# EAGLE design plug (EAGLE 4.16)
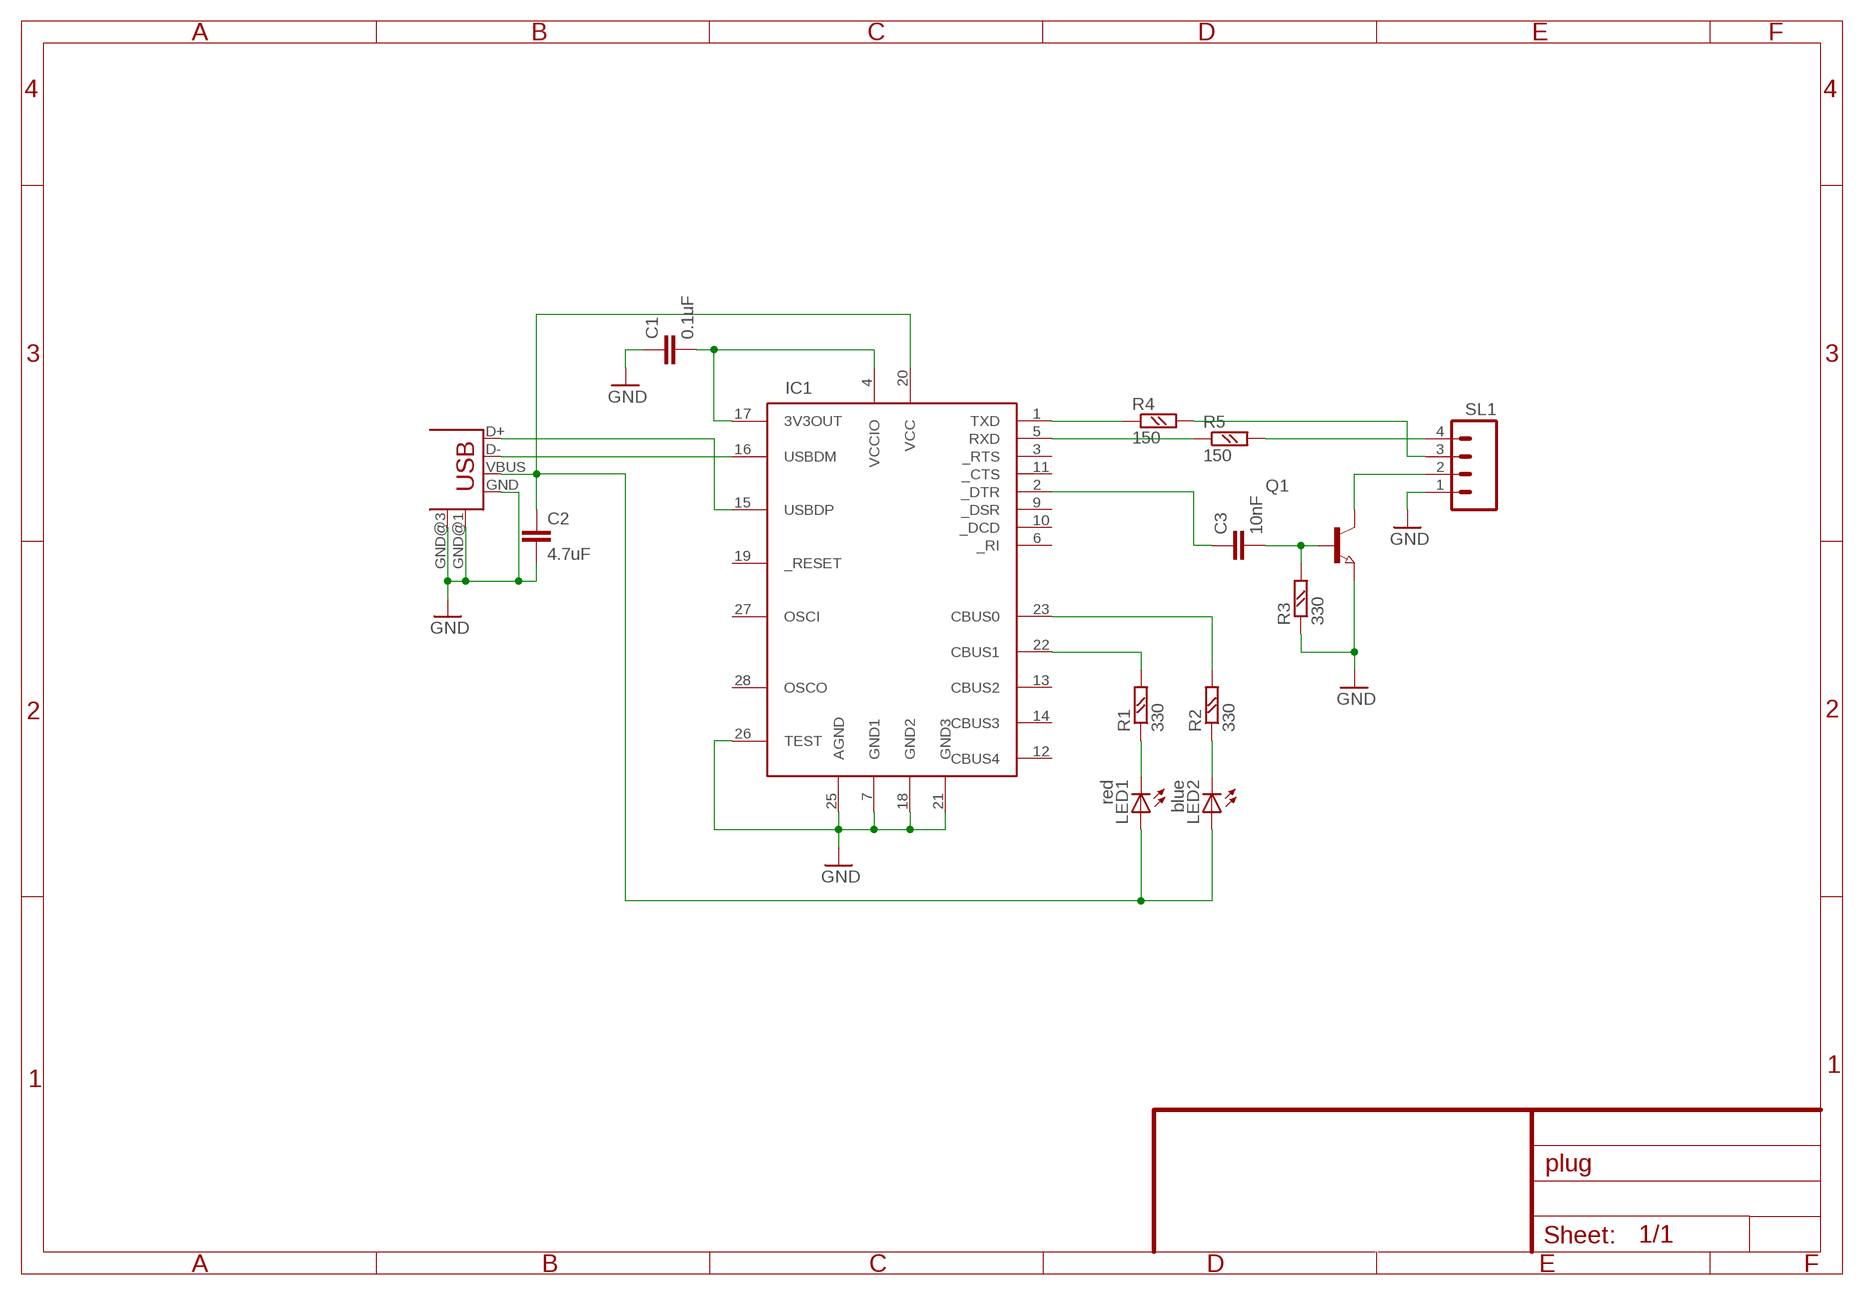
[diagram p0: schematic, sheet 1]

## Parts
C1  0.1uF  C-EUC0805  [C0805]
C2  4.7uF  C-EUC1812  [C1812]
C3  10nF  C-EUC0805  [C0805]
IC1  FT232RL  [SSOP28DB]
LED1  red  LEDCHIPLED_0805  [CHIPLED_0805]
LED2  blue  LEDCHIPLED_0805  [CHIPLED_0805]
Q1  NPN-TRANSISTOR_SOT23W  [SOT23W]
R1  330  R-EU_R0805  [R0805]
R2  330  R-EU_R0805  [R0805]
R3  330  R-EU_R0805  [R0805]
R4  150  R-EU_R0805  [R0805]
R5  150  R-EU_R0805  [R0805]
SL1  MA04  [04PA]
USB1  USB-MB-S  [USB-MB-S]

## Nets
GND: C1.1 C2.2 IC1.7(GND1) IC1.18(GND2) IC1.21(GND3) IC1.25(AGND) IC1.26(TEST) Q1.2(E) R3.1 SL1.1 USB1.GND USB1.GND@1(GND) USB1.GND@3(GND)
N$1: IC1.16(USBDM) USB1.D-
N$2: C1.2 IC1.4(VCCIO) IC1.17(3V3OUT)
N$3: IC1.15(USBDP) USB1.D+
N$4: C3.2 Q1.1(B) R3.2
N$5: C2.1 IC1.20(VCC) LED1.A LED2.A USB1.VBUS
N$6: IC1.1(TXD) R4.1
N$7: IC1.23(CBUS0) R2.2
N$8: IC1.22(CBUS1) R1.2
N$9: LED1.C R1.1
N$10: LED2.C R2.1
N$11: C3.1 IC1.2(_DTR)
N$12: Q1.3(C) SL1.2
N$13: R4.2 SL1.3
N$14: IC1.5(RXD) R5.1
N$16: R5.2 SL1.4
Unconnected: IC1.3(_RTS) IC1.6(_RI) IC1.9(_DSR) IC1.10(_DCD) IC1.11(_CTS) IC1.12(CBUS4) IC1.13(CBUS2) IC1.14(CBUS3) IC1.19(_RESET) IC1.27(OSCI) IC1.28(OSCO)

## Library data of the parts
C1-C3 = main:C-EU: CAPACITOR, European symbol
IC1 = main:FT232RL: USB UART 4th Generation USB UART (USB <-> Serial) Controller
LED1 LED2 = main:LED: LED OSRAM: - CHIPLED LG R971, LG N971, LY N971, LG Q971, LY Q971, LO R971, LY R971 LH N974, LH R974 LS Q976, LO Q976, LY Q976 LO Q996 - Hyper CHIPLED LW Q18S LB Q993, LB Q99A, LB R99A - SideLED LS A670, LO A670, LY A670, LG A670, LP A670 LB A673, LV A673, LT A673, LW A673 LH A674 LY A675 LS A676, LA A676, LO A676, LY A676, LW A676 LS A679, LY A679, LG A679 - Hyper Micro SIDELED® LS Y876, LA Y876, LO Y876, LY Y876 LT Y87S - SmartLED LW L88C, LW L88S LB L89C, LB L89S, LG L890 LS L89K, LO L89K, LY L89K LS L896, LA L896, LO L896, LY L896 - TOPLED LS T670, LO T670, LY T670, LG T670, LP T670 LSG T670, LSP T670, LSY T670, LOP T670, LYG T670 LG T671, LOG T671, LSG T671 LB T673, LV T673, LT T673, LW T673 LH T674 LS T676, LA T676, LO T676, LY T676, LB T676, LH T676, LSB T676, LW T676 LB T67C, LV T67C, LT T67C, LS T67K, LO T67K, LY T67K, LW E67C LS E67B, LA E67B, LO E67B, LY E67B, LB E67C, LV E67C, LT E67C LW T67C LS T679, LY T679, LG T679 LS T770, LO T770, LY T770, LG T770, LP T770 LB T773, LV T773, LT T773, LW T773 LH T774 LS E675, LA E675, LY E675, LS T675 LS T776, LA T776, LO T776, LY T776, LB T776 LHGB T686 LT T68C, LB T68C - Hyper Mini TOPLED® LB M676 - Mini TOPLED Santana® LG M470 LS M47K, LO M47K, LY M47K Source: http://www.osram.convergy.de - LUMILED® LXK2-PW12-R00, LXK2-PW12-S00, LXK2-PW14-U00, LXK2-PW14-V00 LXK2-PM12-R00, LXK2-PM12-S00, LXK2-PM14-U00 LXK2-PE12-Q00, LXK2-PE12-R00, LXK2-PE12-S00, LXK2-PE14-T00, LXK2-PE14-U00 LXK2-PB12-K00, LXK2-PB12-L00, LXK2-PB12-M00, LXK2-PB14-N00, LXK2-PB14-P00, LXK2-PB14-Q00 LXK2-PR12-L00, LXK2-PR12-M00, LXK2-PR14-Q00, LXK2-PR14-R00 LXK2-PD12-Q00, LXK2-PD12-R00, LXK2-PD12-S00 LXK2-PH12-R00, LXK2-PH12-S00 LXK2-PL12-P00, LXK2-PL12-Q00, LXK2-PL12-R00 Source: www.luxeon.com
Q1 = main:NPN-TRANSISTOR_: NPN TRANSISTOR
R1-R5 = main:R-EU_: RESISTOR, European symbol
SL1 = main:MA04: AMP QUICK CONNECTOR
USB1 = main:USB: USB Connectors

## Board
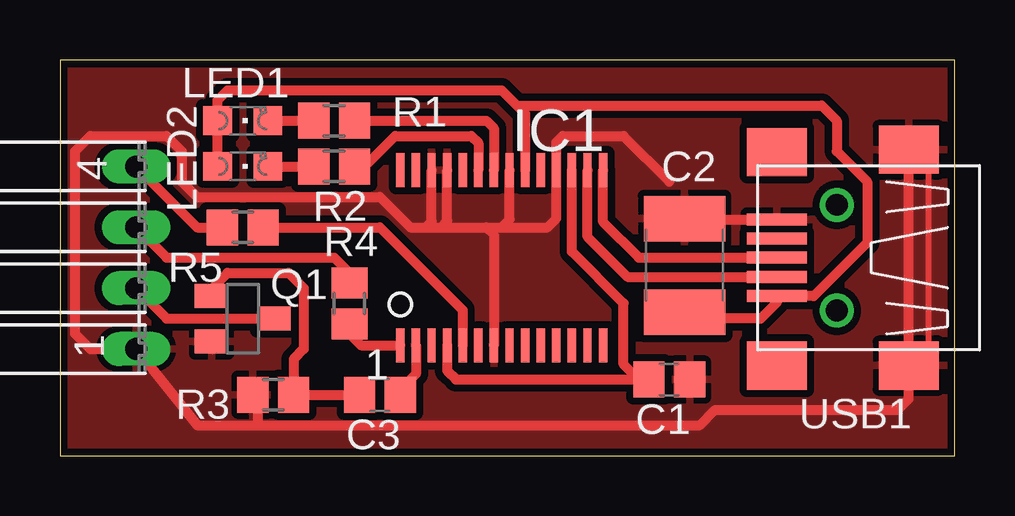
[diagram p1: board, top side]

Size 37.3 x 16.5 mm. Coordinates in mm from the lower left corner, seen from the top.
Outline: 0,0 37.3,0 37.3,16.5 0,16.5 0,0
Copper layers (1*16): Top 0.035mm / dielectric 1.5mm / Bottom 0.035mm
Design rules "resonit-speed-18mkm_new": minimum track width 10mil, minimum drill 0.4mm, track to track 0.16mm, track to pad 0.16mm, pad to pad 0.16mm, via to via 0.16mm, smd to smd 0.16mm, copper to edge 0.3mm, drill to drill 8mil, minimum pad ring 10mil, minimum via ring 8mil, stop-mask expansion 4mil, vias tented up to drill 0.6mm, thermal gap 10mil

### Footprints (pad centres in the part's own frame; a part is rotated, then mirrored left to right if it is on the bottom)
C0805 = smd 1.3 x 1.5: 1 -0.85,0; 2 0.85,0
C1812 = smd 1.9 x 3.4: 1 -1.95,0; 2 1.95,0
SSOP28DB = smd 0.348 x 1.397: 1 -4.225,-3.656; 2 -3.575,-3.656; 3 -2.925,-3.656; 4 -2.275,-3.656; 5 -1.625,-3.656; 6 -0.975,-3.656; 7 -0.325,-3.656; 8 0.325,-3.656; 9 0.975,-3.656; 10 1.625,-3.656; 11 2.275,-3.656; 12 2.925,-3.656; 13 3.575,-3.656; 14 4.225,-3.656; 15 4.225,3.656; 16 3.575,3.656; 17 2.925,3.656; 18 2.275,3.656; 19 1.625,3.656; 20 0.975,3.656; 21 0.325,3.656; 22 -0.325,3.656; 23 -0.975,3.656; 24 -1.625,3.656; 25 -2.275,3.656; 26 -2.925,3.656; 27 -3.575,3.656; 28 -4.225,3.656
CHIPLED_0805 = smd 1.2 x 1.2: A 0,-1.05; C 0,1.05
SOT23W = smd 1 x 1.4: 1 -0.95,-1.303; 2 0.95,-1.303; 3 0,1.303
R0805 = smd 1.3 x 1.5: 1 -0.85,0; 2 0.85,0
04PA = drill 0.914 long: 1 -3.81,0; 2 -1.27,0; 3 1.27,0; 4 3.81,0
USB-MB-S = smd 2.5 x 0.5: D+ 2.5,0; D- 2.5,0.8; GND 2.5,-1.6; ID 2.5,-0.8; VBUS 2.5,1.6 | smd 2.5 x 2: GND@1 -3,4.5; GND@2 2.5,4.5; GND@3 -3,-4.5; GND@4 2.5,-4.4 | drill 0.9 round: P$5 0,2.2; P$6 0,-2.2

### Placement (x,y rotation side)
C1  25.4,3.17 180 top
C2  26.04,7.93 90 top
C3  13.34,2.54 180 top
IC1  18.41,8.25 0 top
LED1  7.62,13.96 270 top
LED2  7.62,12.06 270 top
Q1  7.62,5.71 270 top
R1  11.43,13.96 0 top
R2  11.43,12.06 0 top
R3  8.89,2.54 0 top
R4  12.06,6.34 90 top
R5  7.62,9.52 180 top
SL1  3.17,8.25 90 top
USB1  32.38,8.25 180 top

### Tracks (layer width: path | path; a pad name or v marks a point on that pad's centre or on a via)
GND
  Top 0.254: USB1.GND@1 36.2,4.44 36.2,12.06 USB1.GND@3
  Top 0.406: 25.4,11.42 23.5,13.33 20.95,13.33 20.69,13.06 IC1.18 20.69,9.89 20.32,9.52 18.41,9.52 | 26.04,10.15 C2.2 26.04,9.52 26.36,9.85 USB1.GND | 6.32,4.47 6.35,4.44 | USB1.GND@3 35.38,2.36 34.92,1.9 27.3,1.9 26.67,1.27 8.26,1.27 | C1.1 26.04,3.17 | 15.24,9.52 14.61,9.52 13.34,10.79 5.71,10.79 5.08,11.42 5.08,12.69 4.45,13.33 1.27,13.33 0.64,12.69 0.64,5.08 1.27,4.44 SL1.1 5.71,1.27 8.26,1.27 | 15.24,9.52 15.88,9.52 | 15.88,9.52 17.78,9.52 | 17.78,9.52 18.41,9.52 | IC1.26 15.49,9.77 15.24,9.52 | IC1.25 16.14,9.78 15.88,9.52 | IC1.7 18.09,9.21 17.78,9.52 | IC1.21 18.74,9.84 18.41,9.52 | 7.62,2.54 8.26,1.9 8.26,1.27
  pour Top (isolate 0.305): -1.27,17.14 38.1,17.14 38.1,-0.64 -1.27,-0.64
N$1
  Top 0.406: USB1.D- 23.66,7.45 21.99,9.12 IC1.16
N$2
  Top 0.406: IC1.4 16.14,3.54 16.51,3.17 24.13,3.17 | IC1.17 21.34,8.5 23.5,6.34 23.5,3.81 24.13,3.17 | 24.13,3.17 C1.2
N$3
  Top 0.406: USB1.D+ 24.13,8.25 22.64,9.74 IC1.15
N$4
  Top 0.406: Q1.1 6.32,6.95 6.99,7.62 9.53,7.62 10.16,6.98 10.16,4.44 9.74,4.02 R3.2 | R3.2 9.53,2.54 | R3.2 C3.2
N$5
  Top 0.406: IC1.20 19.39,14.26 19.05,14.6 | 19.05,14.6 18.41,15.23 6.99,15.23 6.57,14.82 LED1.A 6.35,13.96 6.57,13.74 LED2.A | 19.05,14.6 31.75,14.6 32.38,13.96 32.38,12.69 33.66,11.42 33.66,8.88 31.42,6.65 USB1.VBUS 29.89,6.38 29.21,5.71 26.04,5.71 C2.1
N$6
  Top 0.406: R4.1 12.06,5.08 12.55,4.59 IC1.1
N$7
  Top 0.406: IC1.23 17.44,13.03 17.14,13.33 13.97,13.33 12.7,12.06 R2.2
N$8
  Top 0.406: IC1.22 18.09,13.65 17.78,13.96 R1.2 12.06,13.96
N$9
  Top 0.406: LED1.C R1.1
N$10
  Top 0.406: LED2.C R2.1
N$11
  Top 0.406: C3.1 13.97,2.54 14.84,3.41 IC1.2
N$12
  Top 0.406: Q1.3 4.45,5.71 SL1.2
N$13
  Top 0.406: R4.2 12.06,7.62 11.43,8.25 4.45,8.25 SL1.3
N$14
  Top 0.406: IC1.5 16.79,6.07 13.34,9.52 R5.1 8.26,9.52
N$16
  Top 0.406: R5.2 5.71,9.52 SL1.4